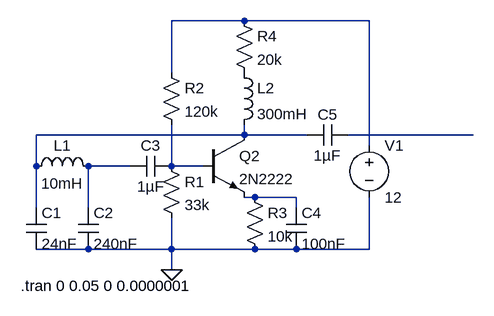
[diagram p0: schematic LCGenerator.asc]
LCGenerator.asc, the LTspice schematic file:
Version 4.1
SHEET 1 880 680
WIRE 384 -144 272 -144
WIRE 576 -144 384 -144
WIRE 272 -64 272 -144
WIRE 384 32 384 16
WIRE 384 32 64 32
WIRE 480 32 384 32
WIRE 736 32 544 32
WIRE 576 48 576 -144
WIRE 64 80 64 32
WIRE 208 80 144 80
WIRE 272 80 272 16
WIRE 320 80 272 80
WIRE 400 128 384 128
WIRE 464 128 400 128
WIRE 64 144 64 80
WIRE 144 144 144 80
WIRE 464 144 464 128
WIRE 144 208 64 208
WIRE 272 208 272 160
WIRE 272 208 144 208
WIRE 400 208 272 208
WIRE 464 208 400 208
WIRE 576 208 576 128
WIRE 576 208 464 208
WIRE 272 240 272 208
FLAG 272 240 0
SYMBOL cap 48 144 R0
SYMATTR InstName C1
SYMATTR Value 24nF
SYMBOL cap 128 144 R0
SYMATTR InstName C2
SYMATTR Value 240nF
SYMBOL ind 48 96 R270
WINDOW 0 32 56 VTop 2
WINDOW 3 5 56 VBottom 2
SYMATTR InstName L1
SYMATTR Value 10mH
SYMBOL cap 272 64 R90
WINDOW 0 0 32 VBottom 2
WINDOW 3 32 32 VTop 2
SYMATTR InstName C3
SYMATTR Value 1µF
SYMBOL res 256 64 R0
SYMATTR InstName R1
SYMATTR Value 33k
SYMBOL res 256 -80 R0
SYMATTR InstName R2
SYMATTR Value 120k
SYMBOL ind 368 -80 R0
SYMATTR InstName L2
SYMATTR Value 300mH
SYMBOL voltage 576 32 R0
WINDOW 123 0 0 Left 0
WINDOW 39 0 0 Left 0
SYMATTR InstName V1
SYMATTR Value 12
SYMBOL cap 448 144 R0
SYMATTR InstName C4
SYMATTR Value 100nF
SYMBOL res 384 112 R0
SYMATTR InstName R3
SYMATTR Value 10k
SYMBOL cap 544 16 R90
WINDOW 0 0 32 VBottom 2
WINDOW 3 32 32 VTop 2
SYMATTR InstName C5
SYMATTR Value 1µF
SYMBOL npn 320 32 R0
SYMATTR InstName Q2
SYMATTR Value 2N2222
SYMBOL res 368 -160 R0
SYMATTR InstName R4
SYMATTR Value 20k
TEXT 40 264 Left 2 !.tran 0 0.05 0 0.0000001

The netlist it stands for:
* LCGenerator.asc
C1 N002 0 24nF
C2 N004 0 240nF
L1 N002 N004 10mH
C3 N005 N004 1µF
R1 N005 0 33k
R2 N001 N005 120k
L2 P001 N002 300mH
V1 N001 0 12
C4 N006 0 100nF
R3 N006 0 10k
C5 N003 N002 1µF
Q2 N002 N005 N006 0 2N2222
R4 N001 P001 20k
.model NPN NPN
.model PNP PNP
.lib standard.bjt
.tran 0 0.05 0 0.0000001
.backanno
.end